# EasyEDA Pro project ProPrj_Altruist.epro, board PCB noise
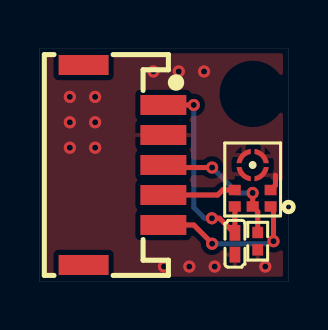
[diagram p3: board, top side]
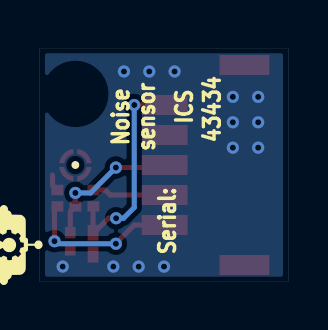
[diagram p4: board, bottom side, seen from below]

Outline 12.45 x 11.68 mm; copper layers: Top Layer, Bottom Layer. Coordinates in mm from the lower left corner of the outline.
Outline path: rectangle 0,11.68 12.45,0
Stack: Top Layer 0.035mm / Dielectric1 1.51mm FR4 er 4.5 / Bottom Layer 0.035mm

## Design rules (mm)
template: JLCPCB Capability(Two Layers Board)
spacing copperThickness1oz (default): track to track 0.102, other pairs 0.152 to 0.3
spacing copperThickness2oz: track to track 0.203, other pairs 0.152 to 0.3
track width copperThickness1oz (default): min 0.127, default 0.254, max 2.54
track width copperThickness2oz: min 0.203, default 0.254, max 2.54
differential pair differentialPair (default): width min 0.127, default 0.254, max 2.54; gap min 0.152, default 0.152
via viaSize (default): diameter min 0.5, default 0.61, max 10; hole min 0.3, default 0.305, max 6.3

## Placement (name value [footprint] x y rotation side)
C1  100nF  [C0402]  9.78 1.91 270 top
CN1  ZX-ZH1.5-5PWT  [CONN-SMD_5P-P1.50_ZX-ZH1.5-5PWT]  4.19 5.84 270 top
R1  100kΩ  [R0402]  10.92 2.03 270 top
U1  ICS-43434  [MIC-SMD_6P-L3.5-W2.7-P0.90-BL]  10.67 5.06 90 top

## Footprints (pads in the part's own frame, mm; a bottom-side part is the same pattern mirrored in y, then rotated)
C0402
  rect 0.79x0.54 smd: 1(-0.545,0) 2(0.545,0)
CONN-SMD_5P-P1.50_ZX-ZH1.5-5PWT
  rect 1x2.3 smd: 1(-3,2) 2(-1.5,2) 3(0,2) 4(1.5,2) 5(3,2)
  rect 1x2.5 smd: 6(5,-2) 7(-5,-2)
MIC-SMD_6P-L3.5-W2.7-P0.90-BL
  rect 0.52x0.6 smd: 1(-1.286,-0.9) 2(-0.465,-0.9) 4(-0.465,0.9) 5(-1.286,0.9) 6(-1.286,0)
  custom 0.709x0.71 smd: 3(0.276,-0.452) 3(0.329,0.505) 3(1.234,-0.505) 3(1.286,0.452)
R0402
  rect 0.566x0.54 smd: 1(-0.433,0) 2(0.433,0)

## Nets
As in the schematic.

Pads without a net: CN1 6 7

## Via types
v1: diameter 0.61, hole 0.305, Top Layer to Bottom Layer, 19 vias

## Routing (per net, layer and track width the routed paths; a pad name or vN(x,y) marks a point on that pad's centre or on a via; arc(x,y) is an arc through that point)
GND: length 0.8
  Top Layer w0.254: U1.2 11.81,4.83 11.81,5.33
  vias: v1(1.5,9.25) v1(1.5,7.98) v1(1.5,6.71) v1(2.77,9.25) v1(2.77,7.98) v1(2.77,6.71) v1(5.69,10.52) v1(6.22,0.76) v1(6.96,10.52) v1(7.49,0.76) v1(8.23,10.52) v1(8.76,0.76) v1(11.3,0.76)
VDD3V3: length 10.6
  Top Layer w0.254: v1(7.72,8.84) CN1.1 ; v1(8.62,3.18) 9.01,3.18 9.74,2.45 C1.1 9.78,3.76 U1.5
  Bottom Layer w0.254: v1(8.62,3.18) 8.25,3.18 7.72,3.72 v1(7.72,8.84)
I2S_SCK: length 3.7
  Top Layer w0.254: CN1.4 8.91,4.34 9.16,4.59 U1.4
I2S_SD: length 7.1
  Top Layer w0.254: CN1.3 6.32,5.72 v1(8.64,5.72) ; R1.1 10.92,3.52 U1.6 v1(10.67,4.44)
  Bottom Layer w0.254: v1(8.64,5.72) 9.91,4.44 v1(10.67,4.44)
I2S_WS: length 7.8
  Top Layer w0.254: v1(8.64,1.91) 8.64,1.92 7.72,2.84 CN1.5 ; U1.1 11.71,3.62 v1(11.71,2.03)
  Bottom Layer w0.254: v1(11.71,2.03) 11.59,1.91 v1(8.64,1.91)

## Copper pours and planes (outline as drawn; the poured copper is in the pictures)
GND on Top Layer: -0.63,11.94 12.57,11.94 12.57,-0.25 -0.63,-0.25
GND on Bottom Layer: -0.51,12.06 12.57,12.06 12.57,-0.25 -0.51,-0.25

## Text on the board
Bottom Silkscreen Layer: 43434 | ICS | Noise / sensor | Serial:
